# EAGLE design RoboBoard (EAGLE 8.1.1)
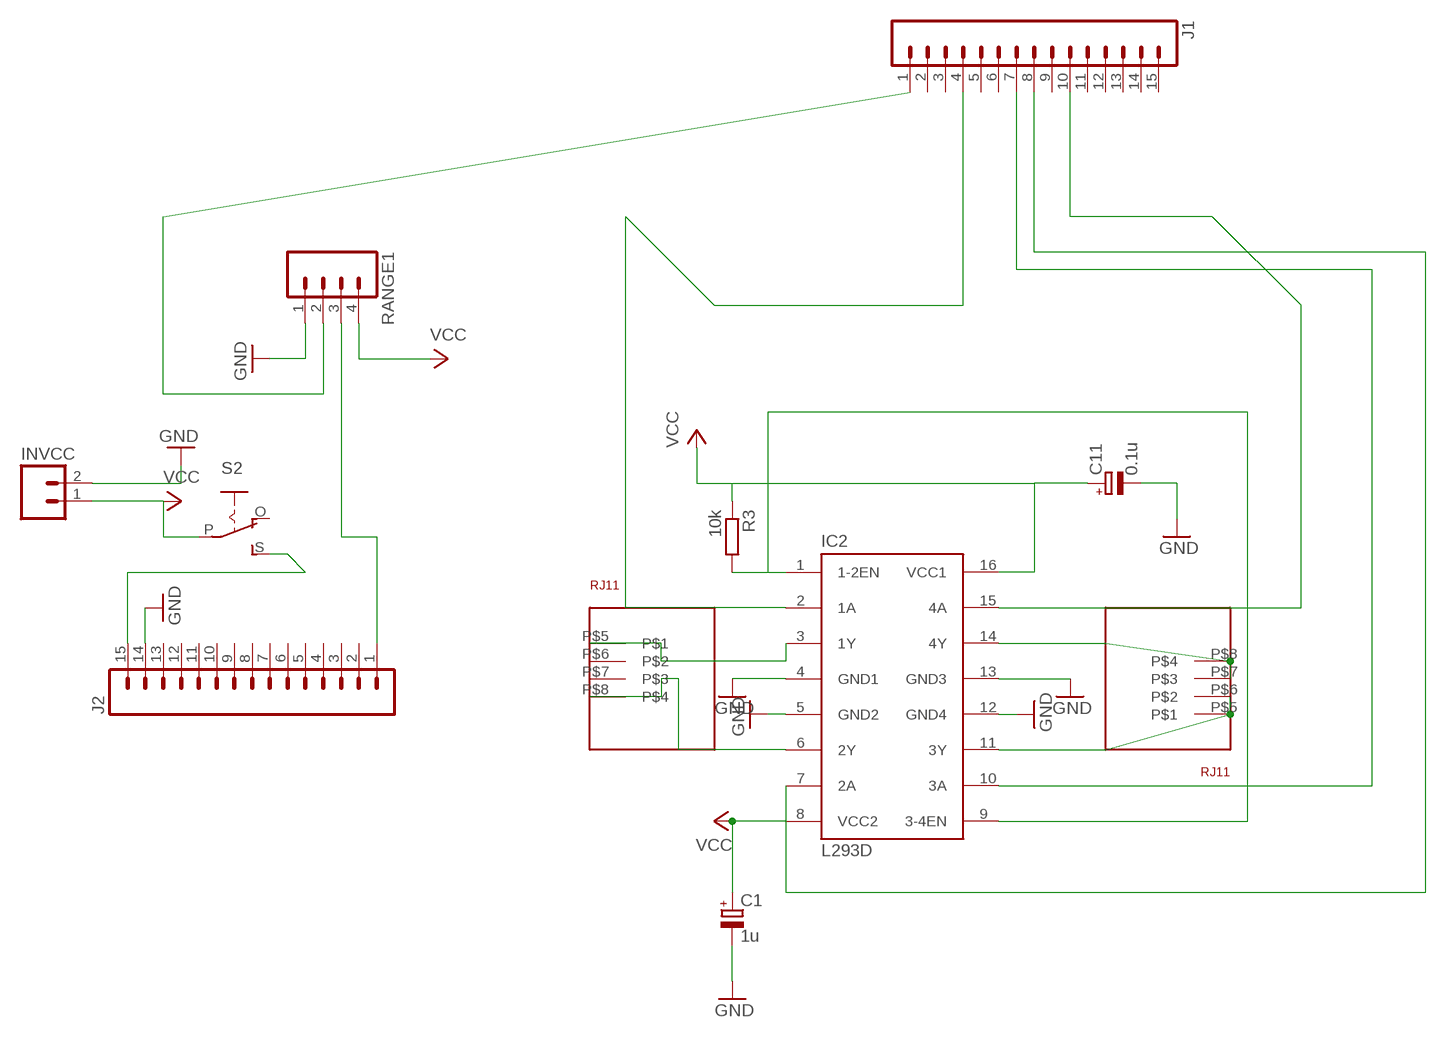
[diagram p0: schematic, sheet 1]

## Parts
C1  1u  CPOL-EUE1.8-4  [E1,8-4]
C11  0.1u  CPOL-EUE1.8-4  [E1,8-4]
IC2  L293D  [DIL16]
INVCC  M02LOCK_LONGPADS  [1X02_LOCK_LONGPADS]
J1  M15LOCK_LONGPADS  [1X15_LOCK_LONGPADS]
J2  M15LOCK_LONGPADS  [1X15_LOCK_LONGPADS]
R3  10k  R-EU_0204/7  [0204/7]
RANGE1  M04LONGPADS  [1X04_LONGPADS]
RJ1  RJ11  [RJ11-4PIN]
RJ2  RJ11  [RJ11-4PIN]
S2  EG1218S  [EG1218]

## Nets
GND: C1.- C11.- IC2.4(GND1) IC2.5(GND2) IC2.12(GND4) IC2.13(GND3) INVCC.2 J2.14 RANGE1.1
N$1: IC2.3(1Y) RJ1.P$5
N$2: IC2.6(2Y) RJ1.P$8
N$3: IC2.11(3Y) RJ2.P$5 RJ2.P$6
N$4: IC2.14(4Y) RJ2.P$7 RJ2.P$8
N$5: IC2.15(4A) J1.10
N$6: J2.1 RANGE1.3
N$7: IC2.10(3A) J1.7
N$8: IC2.1(1-2EN) IC2.9(3-4EN) R3.2
N$9: IC2.7(2A) J1.8
N$10: IC2.2(1A) J1.4
N$12: J1.1 RANGE1.2
N$13: J2.15 S2.S
VCC: C1.+ C11.+ IC2.8(VCC2) IC2.16(VCC1) INVCC.1 R3.1 RANGE1.4 S2.P
Unconnected: J1.2 J1.3 J1.5 J1.6 J1.9 J1.11 J1.12 J1.13 J1.14 J1.15 J2.2 J2.3 J2.4 J2.5 J2.6 J2.7 J2.8 J2.9 J2.10 J2.11 J2.12 J2.13 RJ1.P$6 RJ1.P$7 S2.O

## Library data of the parts
C1 C11 = resistor:CPOL-EU: POLARIZED CAPACITOR, European symbol
IC2 = st-microelectronics:L293D: PUSH-PULL 4 CHANNEL DRIVER; MPN: L293D; OC_FARNELL: 9589619; OC_NEWARK: 56P8249
INVCC = SparkFun-Connectors:M02: Standard 2-pin 0.1" header. Use with - straight break away headers ( PRT-00116) - right angle break away headers (PRT-00553) - swiss pins (PRT-00743) - machine pins (PRT-00117) - female headers (PRT-00115) Molex polarized connector foot print use with: PRT-08233 with associated crimp pins and housings. 2.54_SCREWTERM for use with PRT-10571. 3.5mm Screw Terminal footprints for PRT-08084 5mm Screw Terminal footprints for use with PRT-08432
J1 J2 = SparkFun-Connectors:M15: Header 15 Standard 15-pin 0.1" header. Use with straight break away headers (SKU : PRT-00116), right angle break away headers (PRT-00553), swiss pins (PRT-00743), machine pins (PRT-00117), and female headers (PRT-00115).
R3 = resistor:R-EU_: RESISTOR, European symbol
RANGE1 = SparkFun-Connectors:M04: Header 4 Standard 4-pin 0.1" header. Use with straight break away headers (SKU : PRT-00116), right angle break away headers (PRT-00553), swiss pins (PRT-00743), machine pins (PRT-00117), and female headers (PRT-00115). Molex polarized connector foot print use with SKU : PRT-08231 with associated crimp pins and housings. 1MM SMD Version SKU: PRT-10208; PROD_ID: CONN-09696
RJ1 RJ2 = rj11:RJ11
S2 = adafruit:EG1218: SLIDING SWITCH 0.1" spacing through hole, vertical SPDT slide switch http://www.ladyada.net/library/pcb/eaglelibrary.html

## Board
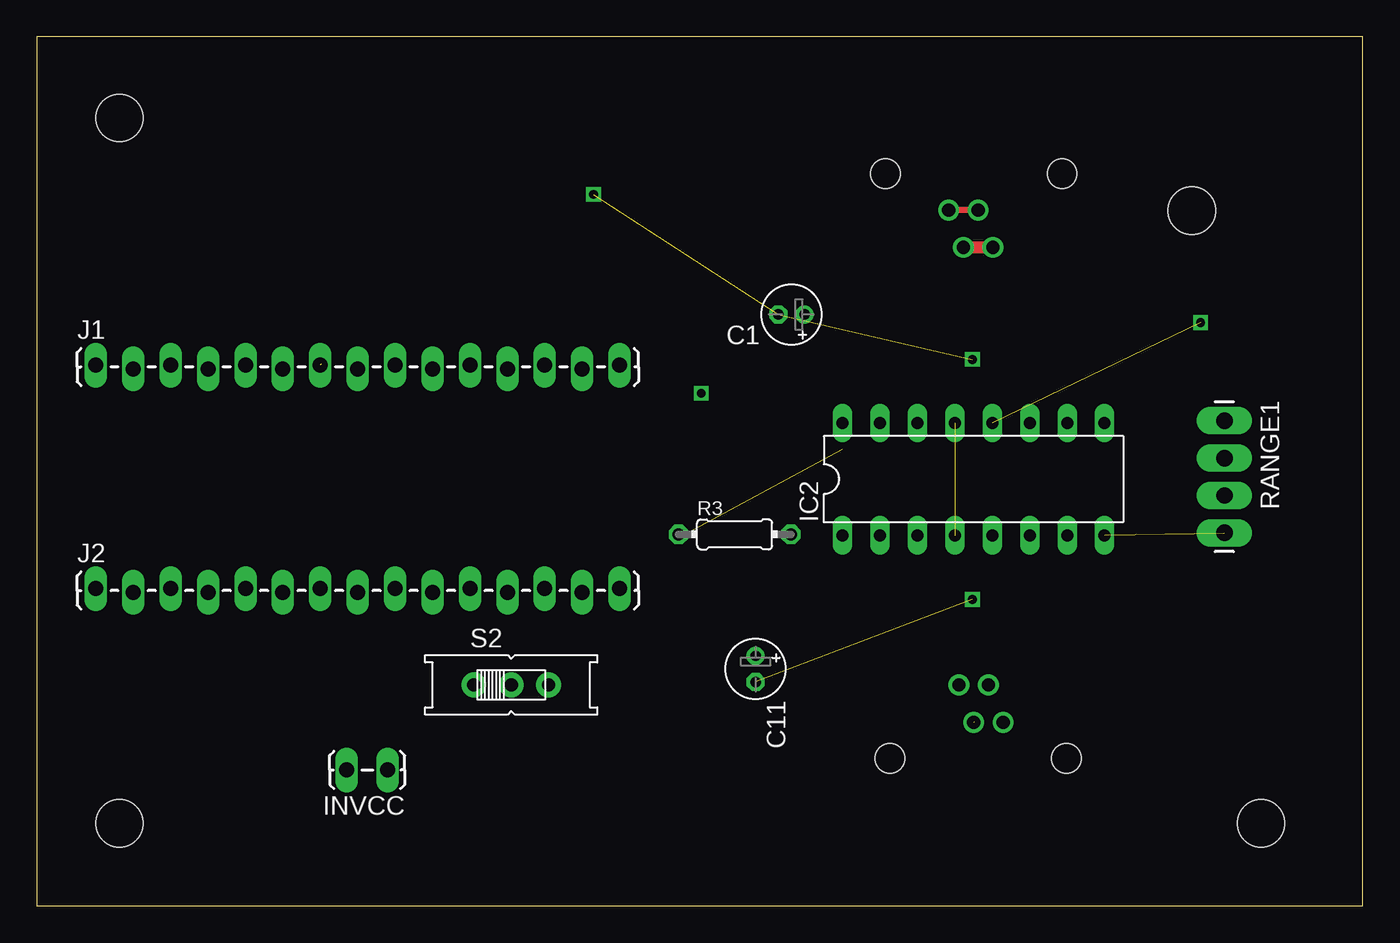
[diagram p1: board, top side]
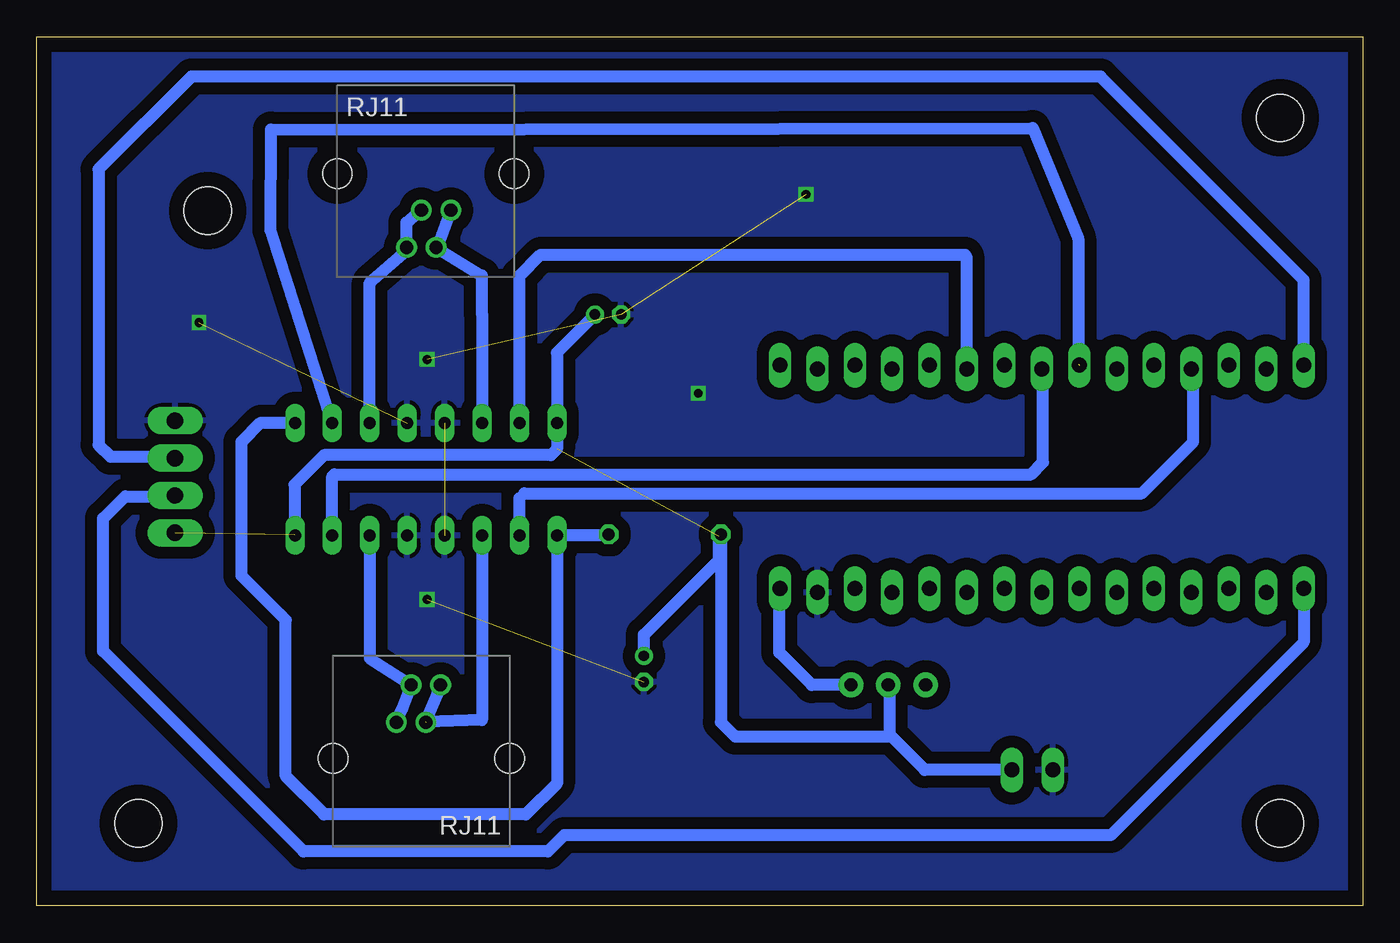
[diagram p2: board, bottom side, seen from below]

Size 90 x 59 mm. Coordinates in mm from the lower left corner, seen from the top.
Outline: 0,0 90,0 90,59 0,59 0,0
Copper layers (1*16): Top 0.035mm / dielectric 1.5mm / Bottom 0.035mm
Design rules "default": minimum track width 10mil, minimum drill 24mil, track to track 8mil, track to pad 8mil, pad to pad 8mil, via to via 8mil, smd to smd 8mil, copper to edge 40mil, drill to drill 8mil, minimum pad ring 10mil, minimum via ring 8mil, stop-mask expansion 4mil, vias tented up to drill 0mil, thermal gap 10mil
Holes 3.2 mm at 5.6,53.5 5.6,5.6 83.1,5.6 78.4,47.2

### Footprints (pad centres in the part's own frame; a part is rotated, then mirrored left to right if it is on the bottom)
E1,8-4 = drill 0.711 pad 1.168: + -0.889,0 | drill 0.711 pad 1.168 octagon: - 0.889,0
DIL16 = drill 0.813 long: 1 -8.89,-3.81; 2 -6.35,-3.81; 3 -3.81,-3.81; 4 -1.27,-3.81; 5 1.27,-3.81; 6 3.81,-3.81; 7 6.35,-3.81; 8 8.89,-3.81; 9 8.89,3.81; 10 6.35,3.81; 11 3.81,3.81; 12 1.27,3.81; 13 -1.27,3.81; 14 -3.81,3.81; 15 -6.35,3.81; 16 -8.89,3.81
1X02_LOCK_LONGPADS = drill 1.016 long: 1 -0.127,0; 2 2.667,0
1X15_LOCK_LONGPADS = drill 1.016 long: 1 0,0.127; 2 2.54,-0.127; 3 5.08,0.127; 4 7.62,-0.127; 5 10.16,0.127; 6 12.7,-0.127; 7 15.24,0.127; 8 17.78,-0.127; 9 20.32,0.127; 10 22.86,-0.127; 11 25.4,0.127; 12 27.94,-0.127; 13 30.48,0.127; 14 33.02,-0.127; 15 35.56,0.127
0204/7 = drill 0.813 octagon: 1 -3.81,0; 2 3.81,0
1X04_LONGPADS = drill 1.118 pad 1.88 long: 1 0,0; 2 2.54,0; 3 5.08,0; 4 7.62,0
RJ11-4PIN = drill 0.9: P$5 5.7,4.54; P$6 7.7,4.54; P$7 4.7,2; P$8 6.7,2 | hole 2: 0,7; 12,7
EG1218 = drill 0.9 pad 1.676: O -2.54,0; P 0,0; S 2.54,0

### Placement (x,y rotation side)
C1  51.22,40.15 180 top
C11  48.79,16.08 270 top
IC2  63.59,28.97 0 top
INVCC  23.7,9.22 180 top
J1  4,36.58 0 top
J2  4,21.41 0 top
R3  47.37,25.22 0 top
RANGE1  80.61,32.94 270 top
RJ1  57.9,17 180 bottom
RJ2  69.6,42.7 0 bottom
S2  32.2,15 0 top

### Tracks (layer width: path | path; a pad name or v marks a point on that pad's centre or on a via)
GND  (via drill 0.6 pad 0.81)  (5 unrouted)
  other vias: 37.8,48.3 63.5,37.1 79,39.6 63.5,20.8 45.1,34.8
  pour Bottom (isolate 0.813): 0.2,58.8 89.8,58.8 89.8,0.1 0.2,0.1
N$1  (1 unrouted)
  Bottom 0.813: IC2.3 59.78,12.62 63.6,12.5 62.8,14.4 62.6,15.1
N$2
  Bottom 0.813: IC2.6 67.4,16.8 RJ1.P$8 65.2,13.4 65.6,12.6
N$3  (via drill 0.6 pad 0.81)
  Top 0.406: v61.9,47.2 RJ2.P$5 RJ2.P$6
  Bottom 0.813: IC2.11 67.4,42.3 64.9,44.5 64.9,46.4 RJ2.P$5 | v61.9,47.2 62.8,44.8
  other vias: 63.9,47.24
N$4  (via drill 0.6 pad 0.81)
  Top 0.813: RJ2.P$7 RJ2.P$8
  Bottom 0.406: 59.8,40.22 59.78,40.2
  Bottom 0.813: 59.78,40.2 IC2.14 | RJ2.P$8 59.8,42.8 59.8,40.22
  other vias: 62.9,44.7
N$5
  Bottom 0.406: 27,44.2 26.9,44.1 | 26.9,36.49 J1.10
  Bottom 0.813: IC2.15 57.24,42.76 55.8,44.2 27,44.2 | 26.9,44.1 26.9,36.49
N$6
  Bottom 0.406: 79.9,27.8 80.55,27.8 RANGE1.3
  Bottom 0.813: J2.1 4,17.9 17.1,4.8 54.2,4.8 55.3,3.7 71.9,3.7 85.5,17.3 85.5,26.3 84,27.8 79.9,27.8
N$7  (1 unrouted)
  Bottom 0.406: 19.3,36.8 18.7,36.2
  Bottom 0.813: IC2.10 74.14,45.86 74.1,52.7 22.4,52.8 19.3,45.3 19.3,36.8
N$8
  Bottom 0.406: 51.24,25.16 R3.2 | 72.5,32.8 IC2.9
  Bottom 0.813: 51.24,25.16 IC2.1 54.7,8.3 56.8,6.2 70.5,6.2 73.1,8.8 73.1,19.4 76.1,22.4 76.1,31.5 74.8,32.8 72.5,32.8
N$9
  Bottom 0.406: 69.94,29.16 69.8,29.3 | 21.7,36.37 J1.8
  Bottom 0.813: IC2.7 69.94,29.16 | 69.8,29.3 22.5,29.3 21.7,30.1 21.7,36.37
N$10
  Bottom 0.406: 57.24,27.66 56.9,28 | 11.5,36.33 J1.4
  Bottom 0.813: IC2.2 57.24,27.66 | 56.9,28 15,28 11.5,31.5 11.5,36.33
N$12
  Bottom 0.406: 80.71,30.5 RANGE1.2
  Bottom 0.813: J1.1 4,42.5 17.8,56.3 79.5,56.3 85.8,50 85.8,31.3 85,30.5 80.71,30.5
N$13
  Bottom 0.406: 39.6,21.5 J2.15
  Bottom 0.813: S2.S 37.4,15 39.6,17.2 39.6,21.5
VCC  (2 unrouted)
  Bottom 0.406: 43.7,25.08 R3.1 | 72.5,25.18 IC2.8 | 32.1,14.9 S2.P | 32.2,11.5 32.1,11.6
  Bottom 0.813: C1.+ 54.7,37.56 IC2.16 54.7,31 55.1,30.6 70.5,30.6 72.5,28.6 72.5,25.18 | C11.+ 48.79,18.41 43.7,23.5 43.7,25.08 | INVCC.1 29.72,9.22 32.1,11.6 32.1,14.9 | R3.1 43.56,12.46 42.6,11.5 32.2,11.5